# EAGLE design ASD2112 (EAGLE 6.3)
DATABASE: ./../../../../../Components/TinyCircuits_Part_Database.txt
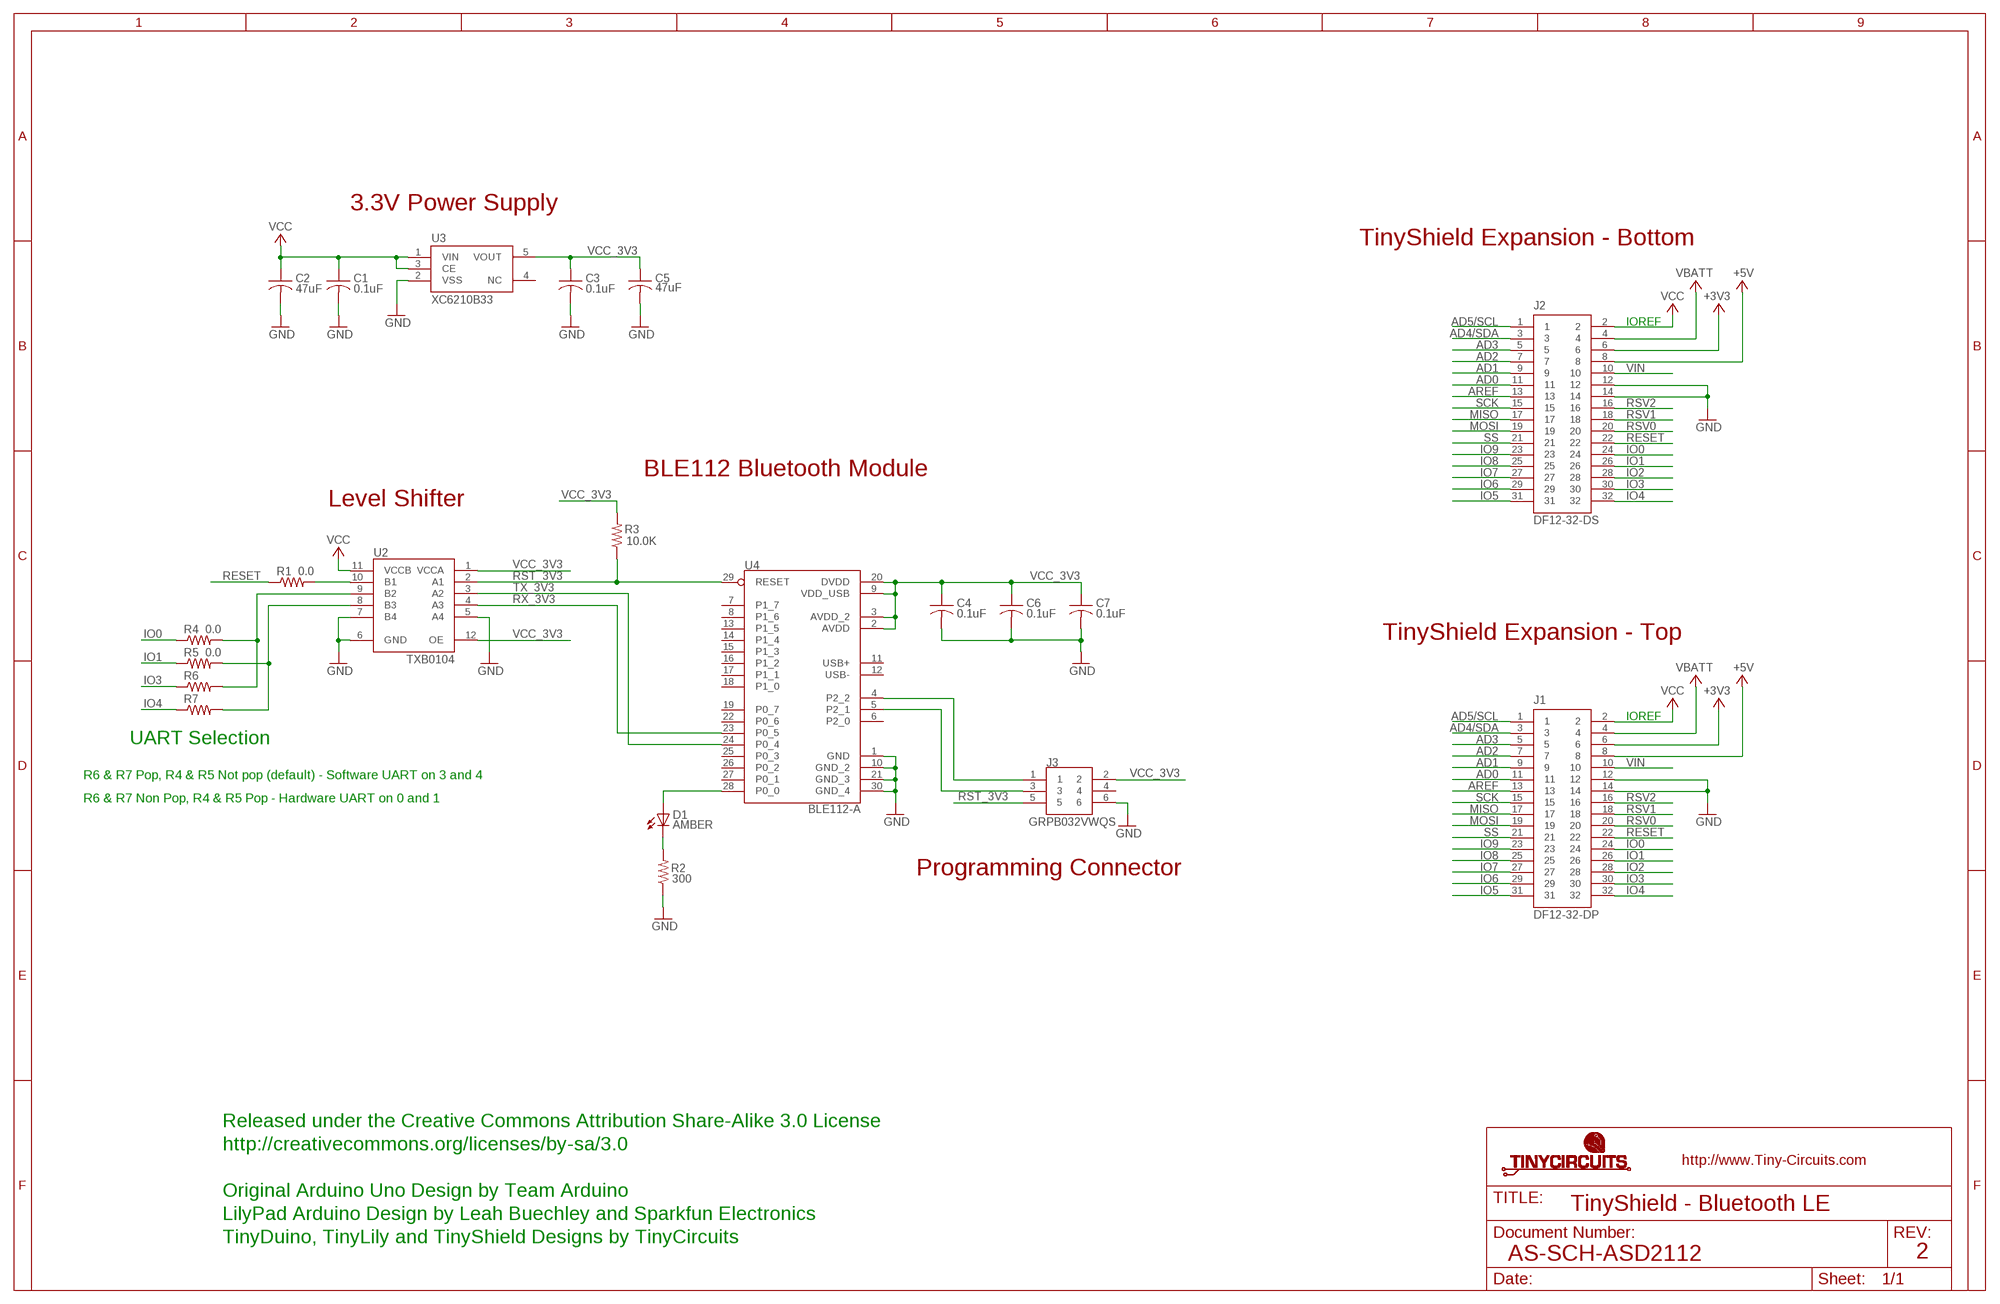
[diagram p0: schematic, sheet 1]

## Parts
C1  0.1uF  AS-ITM-00008  [C0402]
C2  47uF  AS-ITM-00049  [C1206]
C3  0.1uF  AS-ITM-00008  [C0402]
C4  0.1uF  AS-ITM-00008  [C0402]
C5  47uF  AS-ITM-00049  [C1206]
C6  0.1uF  AS-ITM-00008  [C0402]
C7  0.1uF  AS-ITM-00008  [C0402]
D1  AMBER  AS-ITM-00026  [LNJ_LED]
J1  DF12-32-DP  AS-ITM-00015  [DF12-32-DP]
J2  DF12-32-DS  AS-ITM-00012  [DF12-32-DS]
J3  GRPB032VWQS  AS-ITM-00034  [2X3_.05"_SMT_HEADER]
R1  0.0  AS-ITM-00076  [0402]
R2  300  AS-ITM-00016  [0402]
R3  10.0K  AS-ITM-00032  [0402]
R4  0.0  AS-ITM-00076  [0402]
R5  0.0  AS-ITM-00076  [0402]
R6  0.0  AS-ITM-000760402_SHORT  [0402_SHORT]
R7  0.0  AS-ITM-000760402_SHORT  [0402_SHORT]
U2  TXB0104  AS-ITM-00048  [UQFN-12]
U3  XC6210B33  AS-ITM-00046  [SOT-25]
U4  BLE112-A  AS-ITM-00056  [BLUEGIGA_BLE_MODULE]

## Nets
+3V3: J1.6 J2.6
+5V: J1.8 J2.8
AD0: J1.11 J2.11
AD1: J1.9 J2.9
AD2: J1.7 J2.7
AD3: J1.5 J2.5
AD4/SDA: J1.3 J2.3
AD5/SCL: J1.1 J2.1
AREF: J1.13 J2.13
GND: C1.2 C2.2 C3.2 C4.2 C5.2 C6.2 C7.2 J1.12 J1.14 J2.12 J2.14 J3.6 R2.1 U2.5(A4) U2.6(GND) U2.7(B4) U3.2(VSS) U4.1(GND) U4.10(GND_2) U4.21(GND_3) U4.30(GND_4)
IO0: J1.24 J2.24 R4.1
IO1: J1.26 J2.26 R5.1
IO2: J1.28 J2.28
IO3: J1.30 J2.30 R6.1
IO4: J1.32 J2.32 R7.1
IO5: J1.31 J2.31
IO6: J1.29 J2.29
IO7: J1.27 J2.27
IO8: J1.25 J2.25
IO9: J1.23 J2.23
MISO: J1.17 J2.17
MOSI: J1.19 J2.19
N$1: D1.A U4.28(P0_0)
N$2: R4.2 R6.2 U2.9(B2)
N$3: R5.2 R7.2 U2.8(B3)
N$5: J3.3 U4.5(P2_1)
N$6: R1.2 U2.10(B1)
N$7: J3.1 U4.4(P2_2)
N$8: D1.C R2.2
RESET: J1.22 J2.22 R1.1
RST_3V3: J3.5 R3.1 U2.2(A1) U4.29(RESET)
RSV0: J1.20 J2.20
RSV1: J1.18 J2.18
RSV2: J1.16 J2.16
RX_3V3: U2.4(A3) U4.23(P0_5)
SCK: J1.15 J2.15
SS: J1.21 J2.21
TX_3V3: U2.3(A2) U4.24(P0_4)
VBATT: J1.4 J2.4
VCC: C1.1 C2.1 J1.2 J2.2 U2.11(VCCB) U3.1(VIN) U3.3(CE)
VCC_3V3: C3.1 C4.1 C5.1 C6.1 C7.1 J3.2 R3.2 U2.1(VCCA) U2.12(OE) U3.5(VOUT) U4.2(AVDD) U4.3(AVDD_2) U4.9(VDD_USB) U4.20(DVDD)
VIN: J1.10 J2.10
Unconnected: J3.4 U3.4(NC) U4.6(P2_0) U4.7(P1_7) U4.8(P1_6) U4.11(USB+) U4.12(USB-) U4.13(P1_5) U4.14(P1_4) U4.15(P1_3) U4.16(P1_2) U4.17(P1_1) U4.18(P1_0) U4.19(P0_7) U4.22(P0_6) U4.25(P0_3) U4.26(P0_2) U4.27(P0_1)

## Notes on the sheet
- 3.3V Power Supply
- TinyShield Expansion - Bottom
- IOREF
- BLE112 Bluetooth Module
- Level Shifter
- TinyShield Expansion - Top
- IOREF
- UART Selection
- R6 & R7 Pop, R4 & R5 Not pop (default) - Software UART on 3 and 4
- R6 & R7 Non Pop, R4 & R5 Pop - Hardware UART on 0 and 1
- Programming Connector
- Released under the Creative Commons Attribution Share-Alike 3.0 License
- http://creativecommons.org/licenses/by-sa/3.0
- Original Arduino Uno Design by Team Arduino
- TinyShield - Bluetooth LE
- LilyPad Arduino Design by Leah Buechley and Sparkfun Electronics
- TinyDuino, TinyLily and TinyShield Designs by TinyCircuits
- AS-SCH-ASD2112 | 2

## Library data of the parts
C1 C3 C4 C6 C7 = tinycircuits:AS-ITM-00008: CAP CER 0.1UF 16V 10% X5R 0402; PARTNO: AS-ITM-00008
C2 C5 = tinycircuits:AS-ITM-00049: CAP CER 47UF 6.3V 20% X6S 1206; PARTNUM: AS-ITM-00049
D1 = tinycircuits:AS-ITM-00026: LED AMBER SIDE VIEW SMD; PARTNO: AS-ITM-00026
J1 = tinycircuits:AS-ITM-00015: CONN HEADER 32POS 3MM SMD 0.5MM; PARTNO: AS-ITM-00015
J2 = tinycircuits:AS-ITM-00012: CONN RECEPT 32POS 3MM SMD 0.5MM; PARTNO: AS-ITM-00012
J3 = tinycircuits:AS-ITM-00034: CONN HEADER .050" SMD 6POS; PARTNO: AS-ITM-00034
R1 R4 R5 = tinycircuits:AS-ITM-00076: RES 0.0 OHM 1/16W 1% 0402 SMD; PARTNO: AS-ITM-00076
R2 = tinycircuits:AS-ITM-00016: RES 300 OHM 1/16W 1% 0402; PARTNO: AS-ITM-00016
R3 = tinycircuits:AS-ITM-00032: RES 10.0K OHM 1/16W 1% 0402 SMD; PARTNO: AS-ITM-00032
R6 R7 = tinycircuits:AS-ITM-00076: RES 0.0 OHM 1/16W 1% 0402 SMD
U2 = tinycircuits:AS-ITM-00048: IC VOLT-LEVEL TRANSLATOR 12UQFN; PARTNO: AS-ITM-00048
U3 = tinycircuits:AS-ITM-00046: IC REG LDO 3.3V .7A SOT-25; PARTNO: AS-ITM-00046
U4 = tinycircuits:AS-ITM-00056: Bluegiga BLE Bluetooth Module; PARTNO: AS-ITM-00056

## Board
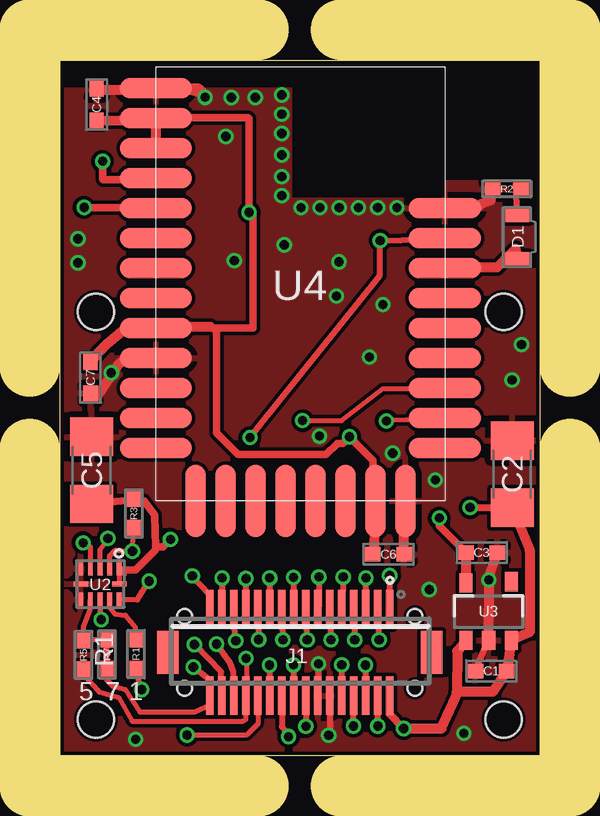
[diagram p1: board, top side]
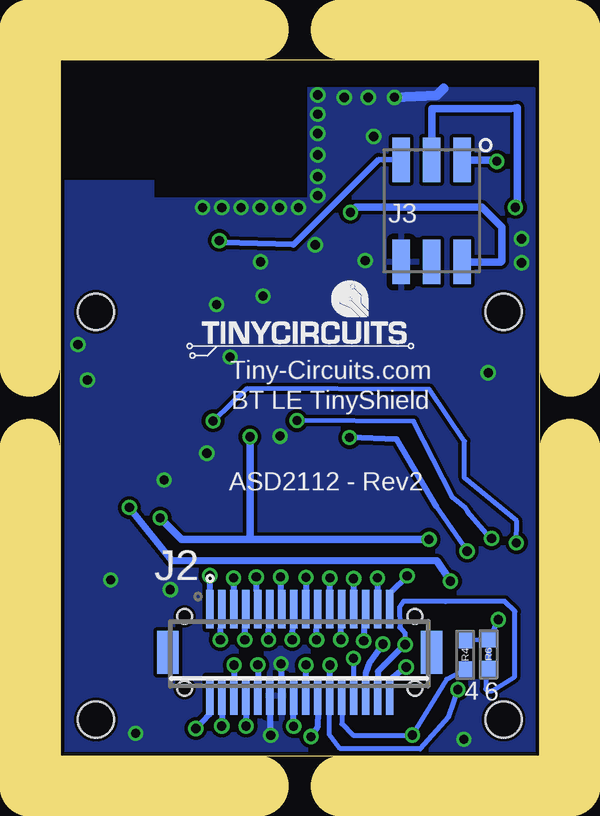
[diagram p2: board, bottom side, seen from below]

Size 20 x 29 mm. Coordinates in mm from the lower left corner, seen from the top.
Outline: 0,29 20,29 20,0 0,0 0,29
Copper layers (1*16): Top 0.035mm / dielectric 1.5mm / Bottom 0.035mm
Design rules "default *": minimum track width 8mil, minimum drill 15mil, track to track 6mil, track to pad 6mil, pad to pad 6mil, via to via 6mil, smd to smd 6mil, copper to edge 6mil, drill to drill 8mil, minimum pad ring 10mil, minimum via ring 5mil, stop-mask expansion 4mil, vias tented up to drill 25mil, thermal gap 10mil
Holes 1.5 mm at 1.5,18.5 18.5,18.5 18.5,1.5 1.5,1.5
tKeepout: area 16,24 to 19.8,27.9
bKeepout: area 16,24 to 19.8,27.9
tRestrict: area 16,24 to 19.8,27.9
bRestrict: area 16,24 to 19.8,27.9
Milling: 8 lines

### Footprints (pad centres in the part's own frame; a part is rotated, then mirrored left to right if it is on the bottom)
C0402 = smd 0.65 x 0.6: 1 -0.65,0; 2 0.65,0
C1206 = smd 1.6 x 1.8: 1 -1.4,0; 2 1.4,0
LNJ_LED = smd 1 x 0.55: A 0,0.9; C 0,-0.9
DF12-32-DP = smd 0.3 x 1.6: 1 -3.75,-1.8; 2 -3.75,1.8; 3 -3.25,-1.8; 4 -3.25,1.8; 5 -2.75,-1.8; 6 -2.75,1.8; 7 -2.25,-1.8; 8 -2.25,1.8; 9 -1.75,-1.8; 10 -1.75,1.8; 11 -1.25,-1.8; 12 -1.25,1.8; 13 -0.75,-1.8; 14 -0.75,1.8; 15 -0.25,-1.8; 16 -0.25,1.8; 17 0.25,-1.8; 18 0.25,1.8; 19 0.75,-1.8; 20 0.75,1.8; 21 1.25,-1.8; 22 1.25,1.8; 23 1.75,-1.8; 24 1.75,1.8; 25 2.25,-1.8; 26 2.25,1.8; 27 2.75,-1.8; 28 2.75,1.8; 29 3.25,-1.8; 30 3.25,1.8; 31 3.75,-1.8; 32 3.75,1.8 | smd 0.9 x 1.8: F1 -5.5,0; F2 5.5,0 | hole 0.6: -4.8,1.5; 4.8,1.5
DF12-32-DS = smd 0.3 x 1.6: 1 -3.75,1.8; 2 -3.75,-1.8; 3 -3.25,1.8; 4 -3.25,-1.8; 5 -2.75,1.8; 6 -2.75,-1.8; 7 -2.25,1.8; 8 -2.25,-1.8; 9 -1.75,1.8; 10 -1.75,-1.8; 11 -1.25,1.8; 12 -1.25,-1.8; 13 -0.75,1.8; 14 -0.75,-1.8; 15 -0.25,1.8; 16 -0.25,-1.8; 17 0.25,1.8; 18 0.25,-1.8; 19 0.75,1.8; 20 0.75,-1.8; 21 1.25,1.8; 22 1.25,-1.8; 23 1.75,1.8; 24 1.75,-1.8; 25 2.25,1.8; 26 2.25,-1.8; 27 2.75,1.8; 28 2.75,-1.8; 29 3.25,1.8; 30 3.25,-1.8; 31 3.75,1.8; 32 3.75,-1.8 | smd 0.9 x 1.8: F1 -5.5,0; F2 5.5,0 | hole 0.6: -4.8,1.5; 4.8,1.5
2X3_.05"_SMT_HEADER = smd 1.854 x 0.737: 1 -2.125,1.27; 2 2.125,1.27; 3 -2.125,0; 4 2.125,0; 5 -2.125,-1.27; 6 2.125,-1.27
0402 = smd 0.65 x 0.55: 1 -0.6,0; 2 0.6,0
0402_SHORT = smd 0.65 x 0.55: 1 -0.6,0; 2 0.6,0
UQFN-12 = smd 0.2 x 0.6: 1 -0.8,-0.65; 2 -0.4,-0.65; 3 0,-0.65; 4 0.4,-0.65; 5 0.8,-0.65; 7 0.8,0.65; 8 0.4,0.65; 9 0,0.65; 10 -0.4,0.65; 11 -0.8,0.65 | smd 0.6 x 0.2: 6 0.8,0; 12 -0.8,0
SOT-25 = smd 0.55 x 0.8: 1 -0.95,-1.2; 2 0,-1.2; 3 0.95,-1.2; 4 0.95,1.25; 5 -0.95,1.2
BLUEGIGA_BLE_MODULE = smd 3 x 0.85: 1 -6,8.2; 2 -6,6.95; 3 -6,5.7; 4 -6,4.45; 5 -6,3.2; 6 -6,1.95; 7 -6,0.7; 8 -6,-0.55; 9 -6,-1.8; 10 -6,-3.05; 11 -6,-4.3; 12 -6,-5.55; 13 -6,-6.8; 22 6.05,-6.8; 23 6.05,-5.55; 24 6.05,-4.3; 25 6.05,-3.05; 26 6.05,-1.8; 27 6.05,-0.55; 28 6.05,0.7; 29 6.05,1.95; 30 6.05,3.2 | smd 0.85 x 3: 14 -4.35,-9; 15 -3.1,-9; 16 -1.85,-9; 17 -0.6,-9; 18 0.65,-9; 19 1.9,-9; 20 3.15,-9; 21 4.4,-9

### Placement (x,y rotation side)
C1  17.98,3.53 180 top
C2  18.86,11.73 90 top
C3  17.59,8.46 0 top
C4  1.53,27.13 90 top
C5  1.32,11.89 90 top
C6  13.7,8.39 0 top
C7  1.28,15.76 270 top
D1  19.08,21.62 180 top
J1  10,4.3 180 top
J2  10,4.3 0 bottom
J3  4.5,22.7 270 bottom
R1  3.17,4.23 90 top
R2  18.64,23.62 0 top
R3  3.09,10.09 90 top
R4  3.1,4.2 90 bottom
R5  0.99,4.2 90 top
R6  2.12,4.23 90 bottom
R7  1.97,4.23 90 top
U2  1.67,7.16 180 top
U3  17.87,6 0 top
U4  10,19.62 0 top
U$1  [DOCFIELD-TINYCIRCUITS-PCB]  33.91,-10 0 top  (outside the outline)

### Tracks (layer width: path | path; a pad name or v marks a point on that pad's centre or on a via)
+3V3  (via drill 0.38)
  Top 0.254: J2.6 v12.75,3.77 v12.74,3.77
  Bottom 0.254: v12.74,3.77 12.74,2.51 J2.6
+5V  (via drill 0.38)
  Top 0.254: v12.24,1.23 J2.8
  Bottom 0.254: J2.8 12.25,1.21 v12.24,1.23
AD0  (via drill 0.38)
  Top 0.254: v11.3,4.83 11.31,5.05 J2.11
  Bottom 0.254: J2.11 11.28,5.79 v11.3,4.83
AD1  (via drill 0.38)
  Top 0.254: J2.9 11.79,6.27 v11.81,7.44
  Bottom 0.254: v11.81,7.44 11.78,6.22 J2.9
AD2  (via drill 0.38)
  Top 0.254: v12.29,4.83 12.31,5.05 J2.7
  Bottom 0.254: J2.7 12.27,5.86 v12.29,4.83
AD3  (via drill 0.38)
  Top 0.254: J2.5 v12.76,7.4
  Bottom 0.254: v12.76,7.4 J2.5
AD4/SDA  (via drill 0.38)
  Top 0.254: v13.31,4.83 13.31,5 J2.3
  Bottom 0.254: J2.3 13.28,5.86 v13.31,4.83
AD5/SCL  (via drill 0.38)
  Top 0.254: v13.75,7.5 J2.1
  Bottom 0.254: J2.1 v13.75,7.5
AREF  (via drill 0.38)
  Top 0.254: J2.13 10.8,6.27 v10.8,7.44
  Bottom 0.254: v10.8,7.44 10.77,6.59 J2.13
GND  (via drill 0.38)
  Top 0.254: v11.21,0.85 11.21,1 11.25,1.04 J2.12 11.25,0.86 v11.21,0.85 | v11.21,0.85 11.21,0.79 11.23,0.77 | C1.2 U3.2 | v10.78,3.82 J2.14
  Top 0.406: C3.2 17.89,7.5 U3.2 | 1.53,27.73 C4.2 1.61,27.77 3.31,27.77 3.23,27.85 4,27.85 U4.1 5.78,27.82 6,27.59 5.19,27.8 4.07,27.8 | C6.2 14.37,10.59 U4.21 | U4.10 2.77,16.57 2.42,16.29 1.58,15 C7.2 | U4.30 17.38,22.82 17.56,22.99 17.96,23.15 R2.1
  Bottom 0.254: 11.25,1.79 11.25,0.86 v11.21,0.85 | J2.14 v10.78,3.82
  Bottom 0.406: v6.05,27.44 4.28,27.54 U4.1
  other vias: 17.89,7.32 16.85,0.92 2.14,15.96 13.47,18.8 12.91,16.62 10.83,13.32 9.25,24.14 11.54,19.16 6.92,25.81 7.27,20.63 18.85,15.65 15.65,11.49 15.4,6.92 9.35,21.29 11.64,20.58 13.88,12.61 9.25,25.04 9.25,25.94 9.25,26.74 9.25,27.54 14.05,22.84 8.15,27.44 7.15,27.44 19.25,17.14 0.75,21.54 0.75,20.54 13.25,22.84 12.45,22.84 10.05,22.84 9.25,23.34 10.85,22.84 11.65,22.84 3.15,0.68
  pour Top: 0.25,27.75 19.75,27.75 19.75,0.25 0.25,0.25
  pour Bottom: 0.25,27.75 19.75,27.75 19.75,0.25 0.25,0.25
IO0  (via drill 0.38)
  Top 0.203: J2.24 8.25,1.32 7.78,0.85 v5.3,0.85
  Bottom 0.203: R4.1 3.87,3.19 v5.3,0.85 7.79,0.85 8.25,1.32 J2.24
IO1  (via drill 0.38)
  Top 0.203: R5.1 0.99,3.35 1.63,2.65 2.45,2.42 3.01,1.43 7.63,1.43 7.75,1.51 J2.26 7.78,2.53 7.78,3.82 v7.77,4.05
  Bottom 0.203: J2.26 7.75,3.85 v7.77,4.05
IO2  (via drill 0.38)
  Top 0.254: v6.53,4.64 7.07,3.89 7.22,3.49 7.29,2.61 7.26,2.51 J2.28
  Bottom 0.254: J2.28 7.24,3.43 7.07,3.88 v6.53,4.64
IO3  (via drill 0.38)
  Top 0.254: J2.30 6.73,3.49 v5.61,4.63
  Bottom 0.203: R6.1 2.24,3.56 2.24,2.78 2.17,2.7 1.96,2.7 1.04,3.28 1.03,6.01 1.46,6.43 3.92,6.42 4.2,6.43 5.67,6.44 5.84,6.18 5.83,5.34 5.61,5.1 v5.61,4.63
  Bottom 0.254: v5.61,4.63 6.75,3.51 6.77,2.53 J2.30
IO4  (via drill 0.38)
  Top 0.203: J2.32 6.25,2.08 5.62,1.81 3.34,1.81 2.72,2.75 2.19,2.9 1.97,3.13 R7.1
  Top 0.254: J2.32 6.25,3.14 v5.56,3.69
  Bottom 0.254: v5.56,3.69 5.61,3.65 6.21,3.18 6.21,3.14 6.26,3.1 J2.32
IO5  (via drill 0.38)
  Top 0.254: v5.52,7.49 6.25,6.72 J2.31
  Bottom 0.254: J2.31 6.21,6.8 v5.52,7.49
IO6  (via drill 0.38)
  Top 0.254: J2.29 6.76,6.11 v6.76,7.4
  Bottom 0.254: J2.29 6.75,7.39 v6.76,7.4
IO7  (via drill 0.38)
  Top 0.254: v7.33,4.78 7.31,4.9 J2.27
  Bottom 0.254: J2.27 7.29,5.76 v7.33,4.78
IO8  (via drill 0.38)
  Top 0.254: J2.25 v7.75,7.37
  Bottom 0.254: v7.75,7.37 J2.25
IO9  (via drill 0.38)
  Top 0.254: v8.29,4.83 8.31,4.98 J2.23
  Bottom 0.254: J2.23 8.28,5.59 v8.29,4.83
MISO  (via drill 0.38)
  Top 0.254: J2.17 v9.75,7.41 v9.74,7.42
  Bottom 0.254: v9.74,7.42 9.74,6.11 J2.17
MOSI  (via drill 0.38)
  Top 0.254: v9.3,4.83 9.31,4.95 J2.19
  Bottom 0.254: J2.19 9.27,5.76 v9.3,4.83
N$1
  Top 0.406: D1.A 19,21.14 18.22,20.35 16.09,20.35 U4.28
N$2  (via drill 0.38)
  Top 0.203: U2.9 1.67,6.02 v1.72,5.67
  Bottom 0.203: v1.72,5.67 2.06,4.94 R6.2 R4.2
N$3
  Top 0.203: U2.8 1.25,6.49 1.26,6.08 0.99,5.38 R5.2 1.01,4.82 R7.2
N$5  (via drill 0.38)
  Top 0.305: v1.01,22.85 4.17,22.85 | 4.17,22.85 4.38,22.85 4.56,22.67 | U4.5 4.13,22.82 4.17,22.85
  Bottom 0.305: J3.3 4.5,26.92 4.49,26.96 1.2,26.96 0.94,27.01 0.94,22.92 v1.01,22.85
N$6
  Top 0.203: 3.17,5.19 3.14,5.06 R1.2 3.14,4.86 3.14,5.35 2.73,5.85 2.29,5.9 2.07,6.17 U2.10
N$7  (via drill 0.38)
  Top 0.305: v1.78,24.77 1.78,24.04 1.8,24.02 3.95,24.02 U4.4
  Bottom 0.305: J3.1 1.83,24.83 v1.78,24.77
N$8
  Top 0.254: D1.C 19.02,23.83 R2.2
RESET  (via drill 0.38)
  Top 0.203: R1.1 3.18,3.42 v3.41,2.75
  Top 0.254: v8.74,3.77 J2.22
  Bottom 0.203: v3.41,2.75 3.79,1.61 4.99,0.28 8.31,0.29 8.77,0.87 8.77,2.48 J2.22
  Bottom 0.254: J2.22 8.75,3.69 v8.74,3.77
RST_3V3  (via drill 0.38)
  Top 0.203: U2.2 2.07,8.32 2.31,8.56 2.5,8.55 v3.02,8.52 3.04,9.24 R3.1 | 16.02,21.53 U4.29
  Top 0.254: v13.36,21.47 16.02,21.53 | v7.92,13.26 8.3,13.73 13.34,20.02 13.34,21.46
  Top 0.305: 13.34,21.46 v13.36,21.47
  Bottom 0.203: v3.02,8.52 4.3,10.39
  Bottom 0.254: 4.3,10.39 5.95,13.18 v7.92,13.26 | J3.5 6.71,24.84 10.26,21.29 13.26,21.38
  Bottom 0.406: 13.26,21.38 v13.36,21.47
RSV0  (via drill 0.38)
  Top 0.254: J2.20 9.25,1.2 v9.54,0.79
  Bottom 0.254: J2.20 9.25,1.84 9.25,1.2 v9.54,0.79
RSV1  (via drill 0.38)
  Top 0.254: v9.74,3.77 9.74,2.51 J2.18
  Bottom 0.254: J2.18 9.75,3.72 v9.74,3.77
RSV2  (via drill 0.38)
  Top 0.254: J2.16 10.25,1.16 v10.25,1.22
  Bottom 0.254: v10.25,1.22 J2.16
RX_3V3  (via drill 0.38)
  Top 0.203: U2.4 1.27,8.7 v0.96,8.87 | v13.61,13.95 13.86,13.99 14.46,14.01 15.82,13.84 U4.23
  Bottom 0.203: v0.96,8.87 0.95,9.77 3.13,11.57 3.13,13.1 4.6,15.26 12.2,15.3 13.57,13.96 13.77,13.86 v13.61,13.95
SCK  (via drill 0.38)
  Top 0.254: v10.31,4.83 10.31,4.98 J2.15
  Bottom 0.254: J2.15 10.29,5.66 v10.31,4.83
SS  (via drill 0.38)
  Top 0.254: v8.75,7.4 J2.21
  Bottom 0.254: J2.21 v8.75,7.39 v8.75,7.4
TX_3V3  (via drill 0.38)
  Top 0.203: U2.3 1.67,8.58 v2,9.05 | v10.12,13.96 11.74,13.97 13.47,15.29 14.93,15.29 15.03,15.2 15.93,15.2 U4.24
  Bottom 0.203: v2,9.05 2.07,9.09 3.01,10.18 3.08,10.3 3.63,10.75 5.26,13.94 v10.12,13.96
VBATT  (via drill 0.38)
  Top 0.254: v13.25,1.23 J2.4
  Bottom 0.254: J2.4 13.25,1.24 v13.25,1.23
VCC  (via drill 0.38)
  Top 0.203: U2.11 3.23,6.51
  Top 0.254: 16.54,2.65 16.61,2.68 | J2.2 13.75,1.73 | 3.23,6.51 v3.72,7.27
  Top 0.305: 13.75,1.73 v14.33,1.12 | v17.11,10.34 C2.1
  Top 0.406: C2.1 19.59,8.57 19.59,5.14 U3.3 C1.1 18.07,2.68 16.61,2.68 15.91,1.12 v14.33,1.12 | U3.1 16.57,4.35 16.54,2.65
  Bottom 0.254: v14.33,1.12 13.77,1.71 J2.2
  Bottom 0.305: v3.72,7.27 4.28,8.11 15.35,8.13 v17.11,10.34
VCC_3V3  (via drill 0.38)
  Top 0.203: U2.12 U2.1 2.53,7.74 | R3.2 2.98,10.61 1.87,10.54
  Top 0.305: C5.1 1.87,10.54 3.06,10.66 3.5,10.6 3.96,10.04 3.98,8.7 | 3.98,8.7 3.98,8.56 3.16,7.74 2.53,7.74 | U4.2 4.02,26.59 7.85,26.59 7.89,26.55 v7.89,22.65 8.04,22.49 8.04,17.81 8.04,17.82 2.9,17.82 | 3.98,8.7 4.29,8.7 v4.61,9.01 | v15.82,9.9 15.82,9.58 C3.1 | 13.12,8.65 13.12,11.05 13.06,11.12 13.06,12.31 v12.08,13.29 11.81,13.02 11.57,13.02 11.1,12.55 7.44,12.55 6.53,13.46 6.53,17.67 6.27,17.92 2.8,17.92 C7.1
  Top 0.406: C3.1 U3.5 | C4.1 4,26.46 | U4.3 4,26.46 | 4,26.46 U4.2 | U4.9 2.9,17.82 2.9,17.79 2.72,17.79 1.96,17.15 1.94,17.15 1.61,16.82 1.35,16.46 C7.1 | C6.1 13.12,8.65 13.14,9.46 13.14,10.28 U4.20
  Bottom 0.305: J3.2 1.62,20.58 1.58,20.62 1.58,22.03 2.42,22.87 7.67,22.87 v7.89,22.65 | v4.61,9.01 11.96,9.01 | 11.96,9.01 14.93,9.01 v15.82,9.9 | v12.08,13.29 12.08,9.12 11.96,9.01
VIN  (via drill 0.38)
  Top 0.254: J2.10 v11.76,3.78 v11.75,3.78
  Bottom 0.254: v11.75,3.78 J2.10

### Text on the board
tPlace: R1 | 5 | 7 | 7 | 1
bPlace: Tiny-Circuits.com | BT LE TinyShield | ASD2112 - Rev2 | 6 | 4
Document: FABRICATION DRAWING | NOTES: | 1. PRINTED CIRCUIT BOARD MADE FROM NEMA GRADE FR-4 EPOXY LAMINATE | WITH 1 OUNCE COPPER PLATING AND .024 THICKNESS. | 2. ALL DIMENSIONS ARE GIVEN IN INCHES. | 3. CIRCUIT PATHS ARE FOR REFERENCE ONLY. | 4. HOLE SIZES SHOWN ARE FINISHED DIAMETERS AFTER PLATING. | 5. BOARD PLATED USING REFLOW OR SIMILAR METHOD. | 6. BOARD TO HAVE BLUE SOLDER MASK ON PLATED SURFACES USING WET FILM | 7. SILKSCREEN BOARD USING WHITE INK. | SR100 OR SR1010 EPOXY. EQUIVALENT WET OR DRY FILM MAY BE USED. | 8. THE FOLLOWING INFORMATION APPLIES TO THIS BOARD: | * 2 COPPER LAYERS | * .024 BOARD THICKNESS | * REQUIRES TOP SIDE SILKSCREEN | Released under the Creative Commons Attribution Share-Alike 3.0 License | http://creativecommons.org/licenses/by-sa/3.0 | Original Arduino Uno Design by Team Arduino | LilyPad Arduino Design by Leah Buechley and Sparkfun Electronics | TinyDuino, TinyLily and TinyShield Designs by TinyCircuits | TinyShield - Bluetooth LE | AS-PCB-ASD2112 | 2